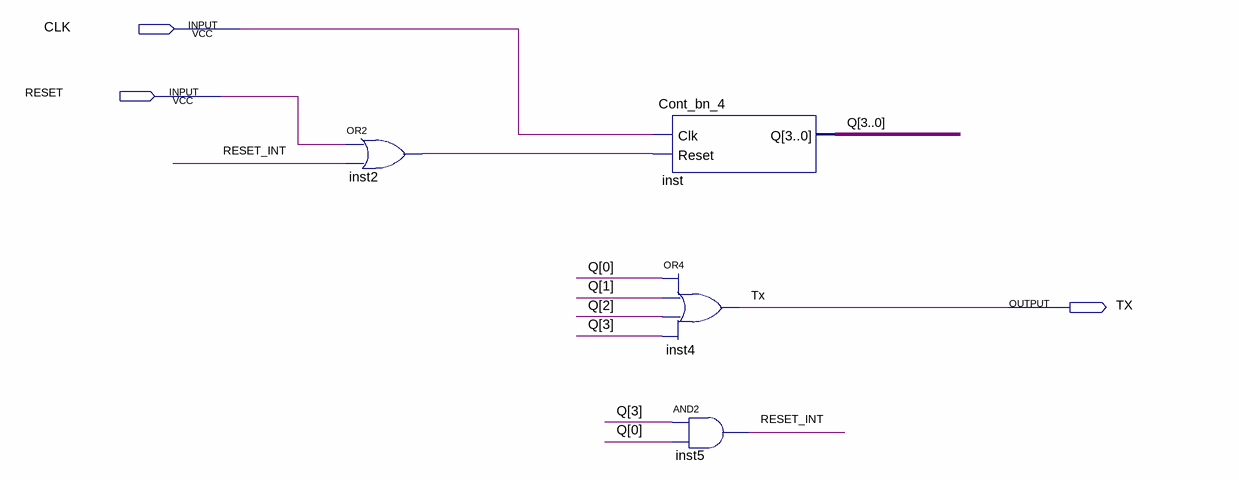
[diagram p0: schematic sheet]
// Quartus schematic COMPTADOR.bdf as structural Verilog: 4 symbols, 3 pins
module COMPTADOR (
  input  CLK,
  input  RESET,
  output TX
);

  wire inst2_out, RESET_INT;
  wire [3:0] Q;

  or inst2 (inst2_out, RESET, RESET_INT);
  Cont_bn_4 inst (.Clk(CLK), .Reset(inst2_out), .Q(Q));
  or inst4 (TX, Q[0], Q[1], Q[2], Q[3]);
  and inst5 (RESET_INT, Q[3], Q[0]);
endmodule
